# Altium schematic sheet GPRS.SchDoc
size A4
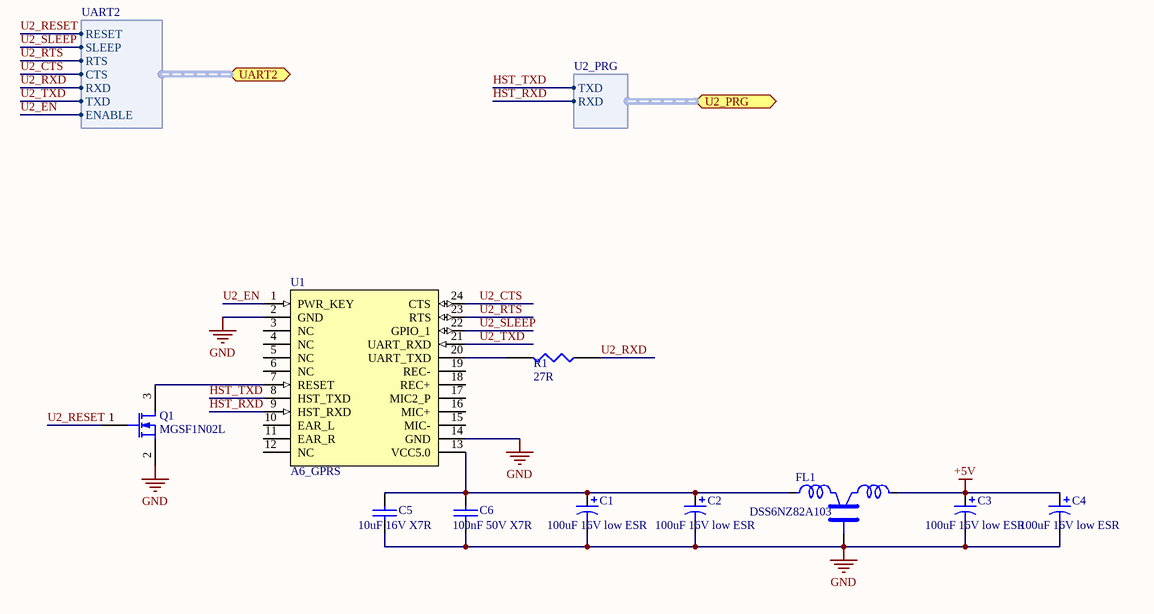
[diagram p0: GPRS.SchDoc]

## Parts
C1  100uF 16V low ESR  [CAPPR2-5x11]
C2  100uF 16V low ESR  [CAPPR2-5x11]
C3  100uF 16V low ESR  [CAPPR2-5x11]
C4  100uF 16V low ESR  [CAPPR2-5x11]
C5  10uF 16V X7R  [CAPC3216N]
C6  100nF 50V X7R  [CAPC2012N]
FL1  DSS6NZ82A103  [DSS6]
Q1  MGSF1N02L  [SOT23-3N]
R1  27R  [RESC2012N]
U1  A6_GPRS  [A6_GPRS_MOD]

## Ports
U2_PRG (harness U2_PRG), UART2 (harness UART2)

## Harnesses
U2_PRG: TXD, RXD
UART2: ENABLE, TXD, RXD, CTS, RTS, SLEEP, RESET

## Nets
+5V: C3.1 C4.1 FL1.3
GND: C1.2 C2.2 C3.2 C4.2 C5.2 C6.2 FL1.2 Q1.2(S) U1.2(GND) U1.14(GND)
HST_RXD: U1.9(HST_RXD) ; port U2_PRG.RXD
HST_TXD: U1.8(HST_TXD) ; port U2_PRG.TXD
U2_CTS: U1.24(CTS) ; port UART2.CTS
U2_EN: U1.1(PWR_KEY) ; port UART2.ENABLE
U2_RESET: Q1.1(G) ; port UART2.RESET
U2_RTS: U1.23(RTS) ; port UART2.RTS
U2_RXD: R1.1 ; port UART2.RXD
U2_SLEEP: U1.22(GPIO_1) ; port UART2.SLEEP
U2_TXD: U1.21(UART_RXD) ; port UART2.TXD
NetC1_1: C1.1 C2.1 C5.1 C6.1 FL1.1 U1.13(VCC5.0)
NetQ1_3: Q1.3(D) U1.7(RESET)
NetR1_2: R1.2 U1.20(UART_TXD)

Not connected (* = marked no-connect by the designer): U1 3(NC) 4(NC) 5(NC) 6(NC) 10(EAR_L) 11(EAR_R) 12(NC) 15(MIC-) 16(MIC+) 17(MIC2_P) 18(REC+) 19(REC-)

## Library data of the parts
C1-C4 = Cap Pol1: Polarized Capacitor (Radial); Price: 0.38
C5 C6 = CAP: Price: 0.025
FL1 = DSS6: Murata EMI suppression filter; Manufacturer: Murata; Price: 0.5
Q1 = MOSFET-N: N-Channel MOSFET; PackageDocument: 1995/1996; Published: 8-Jun-2000; LatestRevisionDate: 17-Jul-2002; LatestRevisionNote: Re-released for DXP Platform.; PackageReference: E3; Publisher: Altium Limited; Price: 0.65
R1 = RES1
U1 = A6_GPRS_Module: GPRS module; Manufacturer: Ai ThinkerTecnology; Price: 23.8